# EAGLE design TinyTX4 (EAGLE 6.5.0)
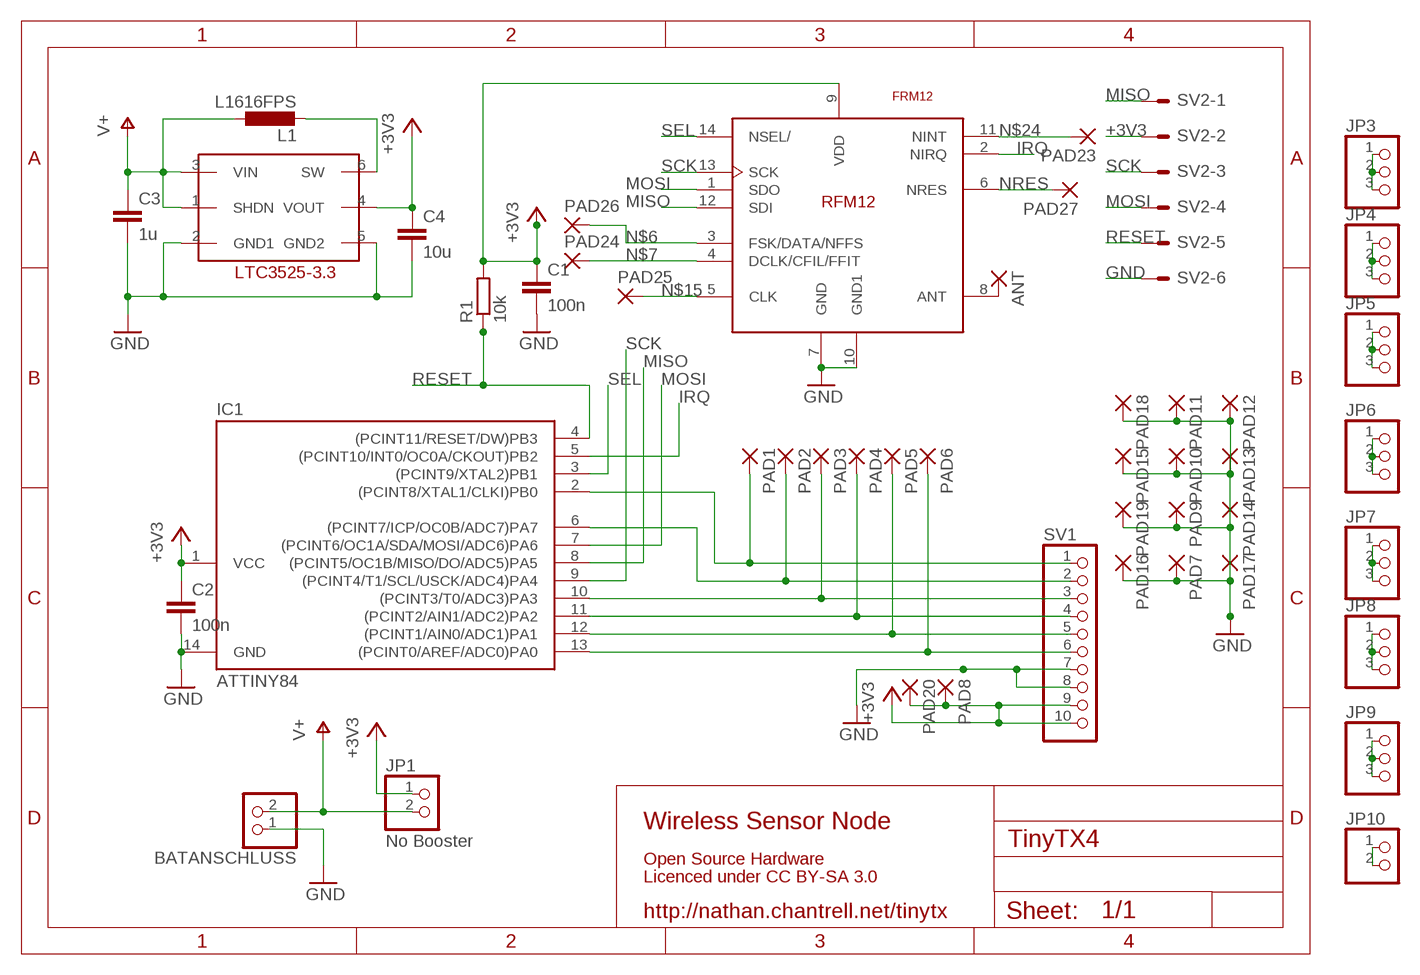
[diagram p0: schematic, sheet 1]

## Parts
ANT  1,6/0,8  [1,6/0,8]
BATANSCHLUSS  PINHD-1X2  [1X02]
C1  100n  C-EUC0805  [C0805]
C2  100n  C-EUC0805  [C0805]
C3  1u  C-EUC0805  [C0805]
C4  10u  C-EUC0805  [C0805]
IC1  ATTINY84  TINY24/44/84-SSU  [SOIC14]
IC2  IC2  LTC3525  [SC70-6]
JP1  No Booster  PINHD-1X2  [1X02]
JP3  PINHD-1X3  [1X03]
JP4  PINHD-1X3  [1X03]
JP5  PINHD-1X3  [1X03]
JP6  PINHD-1X3  [1X03]
JP7  PINHD-1X3  [1X03]
JP8  PINHD-1X3  [1X03]
JP9  PINHD-1X3  [1X03]
JP10  PINHD-1X2  [1X02]
L1  L1616FPS  [L1616]
PAD1  1,6/0,9  [1,6/0,9]
PAD2  1,6/0,9  [1,6/0,9]
PAD3  1,6/0,9  [1,6/0,9]
PAD4  1,6/0,9  [1,6/0,9]
PAD5  1,6/0,9  [1,6/0,9]
PAD6  1,6/0,9  [1,6/0,9]
PAD7  1,6/0,9  [1,6/0,9]
PAD8  1,6/0,9  [1,6/0,9]
PAD9  1,6/0,9  [1,6/0,9]
PAD10  1,6/0,9  [1,6/0,9]
PAD11  1,6/0,9  [1,6/0,9]
PAD12  1,6/0,9  [1,6/0,9]
PAD13  1,6/0,9  [1,6/0,9]
PAD14  1,6/0,9  [1,6/0,9]
PAD15  1,6/0,9  [1,6/0,9]
PAD16  1,6/0,9  [1,6/0,9]
PAD17  1,6/0,9  [1,6/0,9]
PAD18  1,6/0,9  [1,6/0,9]
PAD19  1,6/0,9  [1,6/0,9]
PAD20  1,6/0,9  [1,6/0,9]
PAD23  1,6/0,9  [1,6/0,9]
PAD24  1,6/0,9  [1,6/0,9]
PAD25  1,6/0,9  [1,6/0,9]
PAD26  1,6/0,9  [1,6/0,9]
PAD27  1,6/0,9  [1,6/0,9]
R1  10k  R-EU_R0805  [R0805]
SV1  PINHD-1X10  [1X10]
SV2  ML6E  [ML6]
U$3  FRM12  [RFM12]

## Nets
+3V3: C1.1 C2.1 C4.1 IC1.1(VCC) IC2.4(VOUT) JP1.1 PAD8.1(P) PAD20.1(P) R1.2 SV1.9 SV1.10 SV2.2 U$3.9(VDD)
ANT: ANT.1(P) U$3.8(ANT)
GND: BATANSCHLUSS.1 C1.2 C2.2 C3.2 C4.2 IC1.14(GND) IC2.2(GND1) IC2.5(GND2) PAD7.1(P) PAD9.1(P) PAD10.1(P) PAD11.1(P) PAD12.1(P) PAD13.1(P) PAD14.1(P) PAD15.1(P) PAD16.1(P) PAD17.1(P) PAD18.1(P) PAD19.1(P) SV1.7 SV1.8 SV2.6 U$3.7(GND) U$3.10(GND1)
IRQ: IC1.5((PCINT10/INT0/OC0A/CKOUT)PB2) U$3.2(NIRQ)
MISO: IC1.8((PCINT5/OC1B/MISO/DO/ADC5)PA5) SV2.1 U$3.12(SDI)
MOSI: IC1.7((PCINT6/OC1A/SDA/MOSI/ADC6)PA6) SV2.4 U$3.1(SDO)
N$6: PAD26.1(P) U$3.3(FSK/DATA/NFFS)
N$7: PAD24.1(P) U$3.4(DCLK/CFIL/FFIT)
N$8: IC1.6((PCINT7/ICP/OC0B/ADC7)PA7) PAD2.1(P) SV1.2
N$9: IC1.13((PCINT0/AREF/ADC0)PA0) PAD6.1(P) SV1.6
N$10: IC1.12((PCINT1/AIN0/ADC1)PA1) PAD5.1(P) SV1.5
N$11: IC1.2((PCINT8/XTAL1/CLKI)PB0) PAD1.1(P) SV1.1
N$12: IC2.6(SW) L1.P$2
N$13: IC1.11((PCINT2/AIN1/ADC2)PA2) PAD4.1(P) SV1.4
N$14: IC1.10((PCINT3/T0/ADC3)PA3) PAD3.1(P) SV1.3
N$15: PAD25.1(P) U$3.5(CLK)
N$16: JP3.1 JP3.2 JP3.3
N$17: JP4.1 JP4.2 JP4.3
N$18: JP5.1 JP5.2 JP5.3
N$19: JP10.1 JP10.2
N$20: JP6.1 JP6.2 JP6.3
N$21: JP9.1 JP9.2 JP9.3
N$22: JP7.1 JP7.2 JP7.3
N$23: JP8.1 JP8.2 JP8.3
N$24: PAD23.1(P) U$3.11(NINT)
NRES: PAD27.1(P) U$3.6(NRES)
RESET: IC1.4((PCINT11/RESET/DW)PB3) R1.1 SV2.5
SCK: IC1.9((PCINT4/T1/SCL/USCK/ADC4)PA4) SV2.3 U$3.13(SCK)
SEL: IC1.3((PCINT9/XTAL2)PB1) U$3.14(NSEL/)
V+: BATANSCHLUSS.2 C3.1 IC2.1(SHDN) IC2.3(VIN) JP1.2 L1.P$1

## Notes on the sheet
- Wireless Sensor Node
- Open Source Hardware
- Licenced under CC BY-SA 3.0
- http://nathan.chantrell.net/tinytx

## Library data of the parts
ANT = wirepad:1,6/0,8: THROUGH-HOLE PAD
BATANSCHLUSS JP1 JP10 = pinhead:PINHD-1X2: PIN HEADER
C1-C4 = rcl:C-EU: CAPACITOR, European symbol
IC1 = avr-5:TINY24/44/84
IC2 = ltc3525:LTC3525
JP3-JP9 = pinhead:PINHD-1X3: PIN HEADER
L1 = L1616FSR:L1616FPS
PAD1-PAD20 PAD23-PAD27 = wirepad:1,6/0,9: THROUGH-HOLE PAD
R1 = rcl:R-EU_: RESISTOR, European symbol
SV1 = pinhead:PINHD-1X10: PIN HEADER
SV2 = con-harting-ml:ML6?E: HARTING; OC_FARNELL: unknown; OC_NEWARK: unknown
U$3 = RFM12:FRM12

## Board
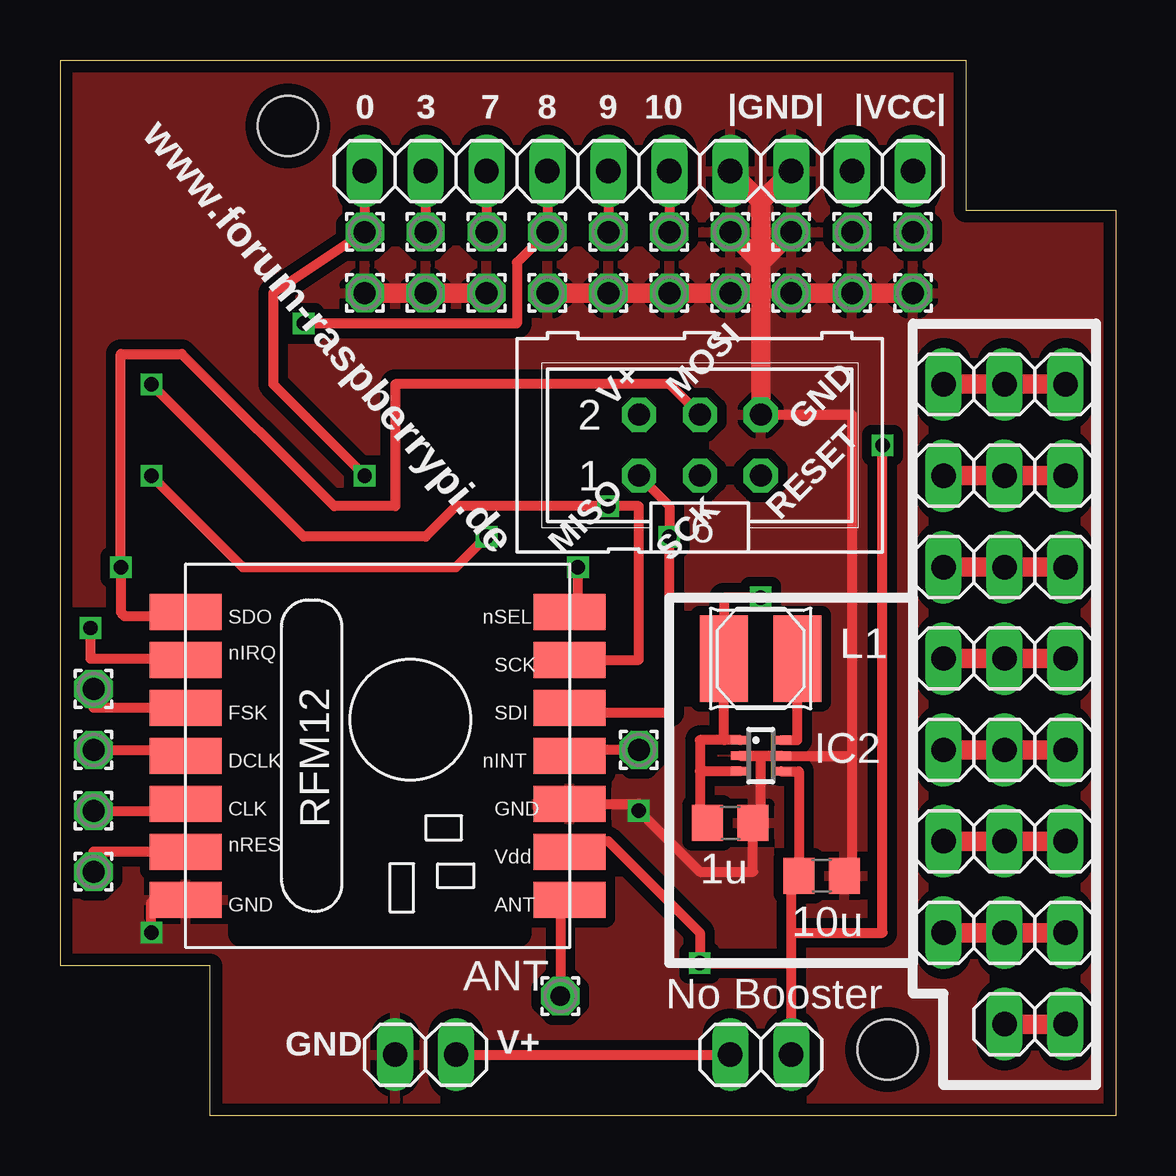
[diagram p1: board, top side]
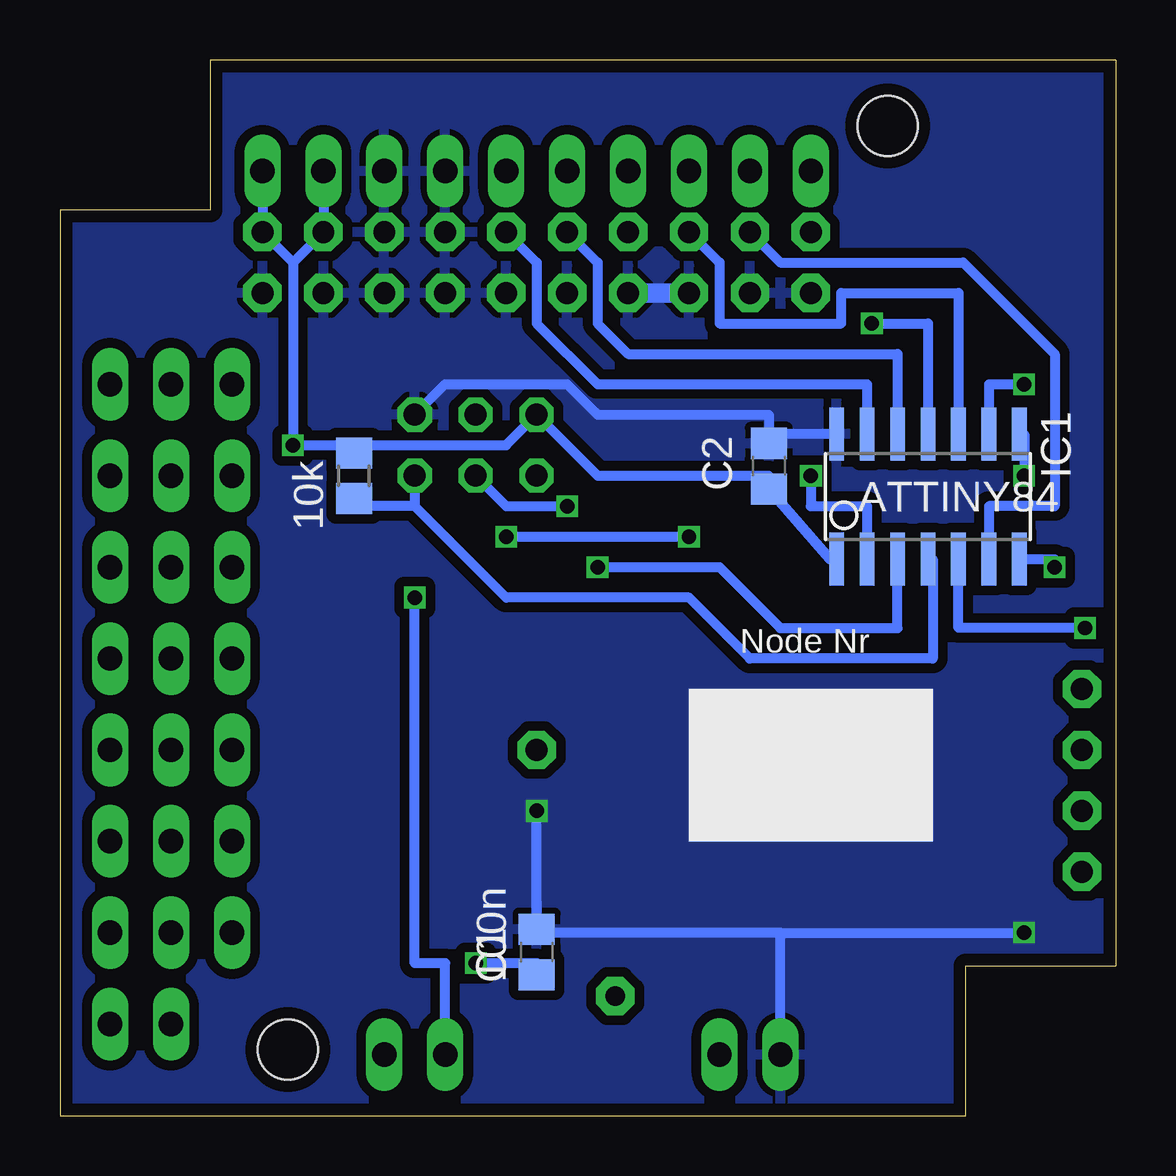
[diagram p2: board, bottom side, seen from below]

Size 44 x 44 mm. Coordinates in mm from the lower left corner, seen from the top.
Outline: 0,44 37.75,44 37.75,37.75 44,37.75 44,0 6.25,0 6.25,6.25 0,6.25 0,44
Copper layers (1*16): Top 0.035mm / dielectric 1.5mm / Bottom 0.035mm
Design rules "smartprototyping": minimum track width 7mil, minimum drill 12mil, track to track 7mil, track to pad 7mil, pad to pad 7mil, via to via 7mil, smd to smd 0mil, copper to edge 20mil, drill to drill 10mil, minimum pad ring 10mil, minimum via ring 6mil, stop-mask expansion 2mil, vias tented up to drill 25mil, thermal gap 10mil
Holes 2.5 mm at 34.5,2.75 9.5,41.25
tRestrict: area 7.6,7.6 to 19.1,21.6

### Footprints (pad centres in the part's own frame; a part is rotated, then mirrored left to right if it is on the bottom)
1,6/0,8 = drill 0.813 pad 1.6 octagon: 1 0,0
1X02 = drill 1.016 long: 1 -1.27,0; 2 1.27,0
C0805 = smd 1.3 x 1.5: 1 -0.95,0; 2 0.95,0
SOIC14 = smd 0.61 x 2.21: 1 -3.81,-2.603; 2 -2.54,-2.603; 3 -1.27,-2.603; 4 0,-2.603; 5 1.27,-2.603; 6 2.54,-2.603; 7 3.81,-2.603; 8 3.81,2.603; 9 2.54,2.603; 10 1.27,2.603; 11 0,2.603; 12 -1.27,2.603; 13 -2.54,2.603; 14 -3.81,2.603
SC70-6 = smd 0.35 x 0.8: 1 -0.65,-0.85; 2 0,-0.85; 3 0.65,-0.85; 4 0.65,0.85; 5 0,0.85; 6 -0.65,0.85
1X03 = drill 1.016 long: 1 -2.54,0; 2 0,0; 3 2.54,0
L1616 = smd 2 x 3.6: P$1 -1.525,0; P$2 1.525,0
1,6/0,9 = drill 0.914 pad 1.6 octagon: 1 0,0
R0805 = smd 1.3 x 1.5: 1 -0.95,0; 2 0.95,0
1X10 = drill 1.016 long: 1 -11.43,0; 2 -8.89,0; 3 -6.35,0; 4 -3.81,0; 5 -1.27,0; 6 1.27,0; 7 3.81,0; 8 6.35,0; 9 8.89,0; 10 11.43,0
ML6 = drill 0.914 octagon: 1 -2.54,-1.27; 2 -2.54,1.27; 3 0,-1.27; 4 0,1.27; 5 2.54,-1.27; 6 2.54,1.27
RFM12 = smd 1.5 x 3: 1 -5,-10; 2 -3,-10; 3 -1,-10; 4 1,-10; 5 3,-10; 6 5,-10; 7 7,-10; 8 7,6; 9 5,6; 10 3,6; 11 1,6; 12 -1,6; 13 -3,6; 14 -5,6

### Placement (x,y rotation side)
ANT  20.86,4.98 0 top
BATANSCHLUSS  15.24,2.54 0 top
C1  24.13,6.81 90 bottom
C2  14.45,27.07 90 bottom
C3  27.94,12.2 0 top
C4  31.75,10 0 top
IC1  7.82,25.8 0 bottom
IC2  29.21,15 270 top
JP1  29.21,2.54 180 top
JP3  39.37,30.48 0 top
JP4  39.37,26.67 0 top
JP5  39.37,22.86 0 top
JP6  39.37,19.05 0 top
JP7  39.37,15.24 0 top
JP8  39.37,11.43 0 top
JP9  39.37,7.62 0 top
JP10  40.64,3.81 0 top
L1  29.21,19.05 0 top
PAD1  12.7,36.83 0 top
PAD2  15.24,36.83 0 top
PAD3  17.78,36.83 0 top
PAD4  20.32,36.83 0 top
PAD5  22.86,36.83 0 top
PAD6  25.4,36.83 0 top
PAD7  27.94,36.83 0 top
PAD8  33.02,36.83 0 top
PAD9  12.7,34.29 0 top
PAD10  15.24,34.29 0 top
PAD11  17.78,34.29 0 top
PAD12  20.32,34.29 0 top
PAD13  22.86,34.29 0 top
PAD14  25.4,34.29 0 top
PAD15  27.94,34.29 0 top
PAD16  30.48,34.29 0 top
PAD17  30.48,36.83 0 top
PAD18  33.02,34.29 0 top
PAD19  35.56,34.29 0 top
PAD20  35.56,36.83 0 top
PAD23  24.13,15.24 0 top
PAD24  1.4,15.24 0 top
PAD25  1.4,12.7 0 top
PAD26  1.4,17.78 0 top
PAD27  1.4,10.16 0 top
R1  31.75,26.67 90 bottom
SV1  24.13,39.37 0 top
SV2  26.67,27.94 0 top
U$3  15.24,16 270 top

### Tracks (layer width: path | path; a pad name or v marks a point on that pad's centre or on a via)
+3V3  (via drill 0.6)
  Top 0.406: 30.48,7.62 30.48,10.16 C4.1 30.8,14.35 IC2.4 | JP1.1 30.48,6.35 | 30.48,6.35 30.48,7.62 | 30.48,7.62 34.29,7.62 v34.29,27.94 | 30.48,6.35 v26.67,6.35 26.67,7.62 22.86,11.43 21.67,11.43 U$3.9
  Bottom 0.406: IC1.1 11.91,23.2 C2.1 14.45,26.67 21.59,26.67 SV2.2 25.4,27.94 31.75,27.94 | C1.1 24.13,6.35 v26.67,6.35 | 31.75,27.94 v34.29,27.94 34.29,35.56 | SV1.9 PAD8.1 34.29,35.56 | SV1.10 PAD20.1 34.29,35.56 | R1.2 31.75,27.94
ANT
  Top 0.406: U$3.8 20.86,9 ANT.1
GND  (via drill 0.6)
  Top 0.406: SV2.6 33.02,29.21 33.02,15 | 33.02,15 33.02,10.16 C4.2 | U$3.10 24.13,13 v24.13,12.7 26.67,10.16 28.89,10.16 C3.2 29.21,12.2 29.21,15 | 3.97,7.62 v3.81,7.62 3.81,8.89 U$3.7 | 29.21,34.29 PAD16.1 | 33.02,15 IC2.2 29.21,15 | IC2.5 29.21,15
  Top 0.813: PAD17.1 29.21,35.56 | 29.21,35.56 PAD7.1 | PAD12.1 PAD13.1 PAD14.1 PAD15.1 29.21,34.29 | PAD16.1 PAD18.1 PAD19.1 | PAD11.1 PAD10.1 PAD9.1 | SV2.6 29.21,34.29 | SV1.8 29.21,38.1 | 29.21,38.1 29.21,35.56 | SV1.7 29.21,38.1 | 29.21,35.56 29.21,34.29
  Bottom 0.406: BATANSCHLUSS.1 13.97,7.62 | 13.97,7.62 24.13,7.62 C1.2 | C1.2 v24.13,12.7 | IC1.14 14.45,28.4 C2.2 | SV2.6 27.94,30.48 22.86,30.48 21.59,29.21 14.45,29.21 C2.2 | C2.2 13.97,28.02 | 24.13,8.89 C1.2 | 13.97,7.62 v3.81,7.62
  Bottom 0.813: PAD11.1 PAD12.1
  pour Bottom (isolate 0.406): 0,44.45 44.45,44.45 44.45,0 0,0
  pour Top (isolate 0.406): 0,44.45 44.45,44.45 44.45,0 0,0
IRQ  (via drill 0.6)
  Top 0.406: v1.27,20.32 1.27,19.05 5.24,19.05 U$3.2
  Bottom 0.406: v1.27,20.32 6.55,20.32 IC1.5
MISO  (via drill 0.6)
  Top 0.406: v3.81,26.67 7.62,22.86 16.51,22.86 v17.78,24.13 | U$3.12 19.97,16.81 25.4,16.81 v25.4,24.13 25.4,25.4 SV2.1
  Bottom 0.406: IC1.8 3.81,28.4 v3.81,26.67 | v25.4,24.13 v17.78,24.13
MOSI  (via drill 0.6)
  Top 0.406: SV2.4 25.4,30.48 13.97,30.48 13.97,25.4 11.43,25.4 5.08,31.75 2.54,31.75 v2.54,22.86 2.54,20.98 2.7,20.82 3.79,20.82 U$3.1
  Bottom 0.406: IC1.7 2.54,23.2 v2.54,22.86
N$6
  Top 0.406: U$3.3 1.4,17 PAD26.1
N$7
  Top 0.406: PAD24.1 5.24,15.24 U$3.4
N$8
  Top 0.406: SV1.2 PAD2.1
  Bottom 0.406: PAD2.1 13.97,35.56 6.35,35.56 2.54,31.75 2.54,25.4 5.28,25.4 IC1.6
N$9
  Top 0.406: SV1.6 PAD6.1
  Bottom 0.406: PAD6.1 24.13,35.56 24.13,33.02 21.59,30.48 10.36,30.48 IC1.13
N$10
  Top 0.406: SV1.5 PAD5.1
  Bottom 0.406: PAD5.1 21.59,35.56 21.59,33.02 20.32,31.75 9.09,31.75 IC1.12
N$11  (via drill 0.6)
  Top 0.406: SV1.1 PAD1.1 8.89,34.29 8.89,30.48 v12.7,26.67
  Bottom 0.406: v12.7,26.67 12.7,25.4 10.36,25.4 IC1.2
N$12
  Top 0.406: IC2.6 30.73,15.65 L1.P$2
N$13  (via drill 0.6)
  Top 0.406: SV1.4 PAD4.1 19.05,35.56 19.05,33.02 v10.16,33.02
  Bottom 0.406: v10.16,33.02 7.82,33.02 IC1.11
N$14
  Top 0.406: SV1.3 PAD3.1
  Bottom 0.406: PAD3.1 16.51,35.56 16.51,33.02 11.43,33.02 11.43,34.29 6.55,34.29 IC1.10
N$15
  Top 0.406: PAD25.1 5.24,12.7 U$3.5
N$16
  Top 0.813: JP3.3 JP3.2 JP3.1
N$17
  Top 0.813: JP4.1 JP4.2 JP4.3
N$18
  Top 0.813: JP5.1 JP5.2 JP5.3
N$19
  Top 0.813: JP10.2 JP10.1
N$20
  Top 0.813: JP6.3 JP6.2 JP6.1
N$21
  Top 0.813: JP9.1 JP9.2 JP9.3
N$22
  Top 0.813: JP7.1 JP7.2 JP7.3
N$23
  Top 0.813: JP8.3 JP8.2 JP8.1
N$24
  Top 0.406: PAD23.1 21.24,15.24 U$3.11
NRES
  Top 0.406: U$3.6 1.4,11 PAD27.1
RESET
  Bottom 0.406: IC1.4 7.62,23.2 7.62,19.05 15.24,19.05 17.78,21.59 25.4,21.59 29.21,25.4 | 29.21,25.4 31.75,25.4 R1.1 | SV2.5 29.21,25.4
SCK  (via drill 0.6)
  Top 0.406: v3.81,30.48 10.16,24.13 15.24,24.13 16.51,25.4 v22.86,25.4 24.13,25.4 24.13,19 U$3.13
  Bottom 0.406: v3.81,30.48 5.28,30.48 IC1.9 | v22.86,25.4 25.4,25.4 SV2.3
SEL  (via drill 0.6)
  Top 0.406: v21.59,22.86 21.59,21 U$3.14
  Bottom 0.406: v21.59,22.86 16.51,22.86 13.97,20.32 9.09,20.32 IC1.3
V+  (via drill 0.6)
  Top 0.406: C3.1 26.67,12.7 26.67,14.35 | BATANSCHLUSS.2 JP1.2 | v29.21,21.59 27.68,21.59 L1.P$1 27.68,15.65 IC2.1 26.67,15.65 26.67,14.35 | IC2.3 26.67,14.35
  Bottom 0.406: JP1.2 27.94,6.35 29.21,6.35 v29.21,21.59

### Text on the board
tNames: 0 | 3 | 7 | 8 | 9 | 10 | |GND| | |VCC| | V+ | MOSI | GND | RESET | www.forum-raspberrypi.de | MISO | SCK | GND | V+
_bsilk: Node Nr